# Altium project Power_board_teensy V2.0.PrjPcb
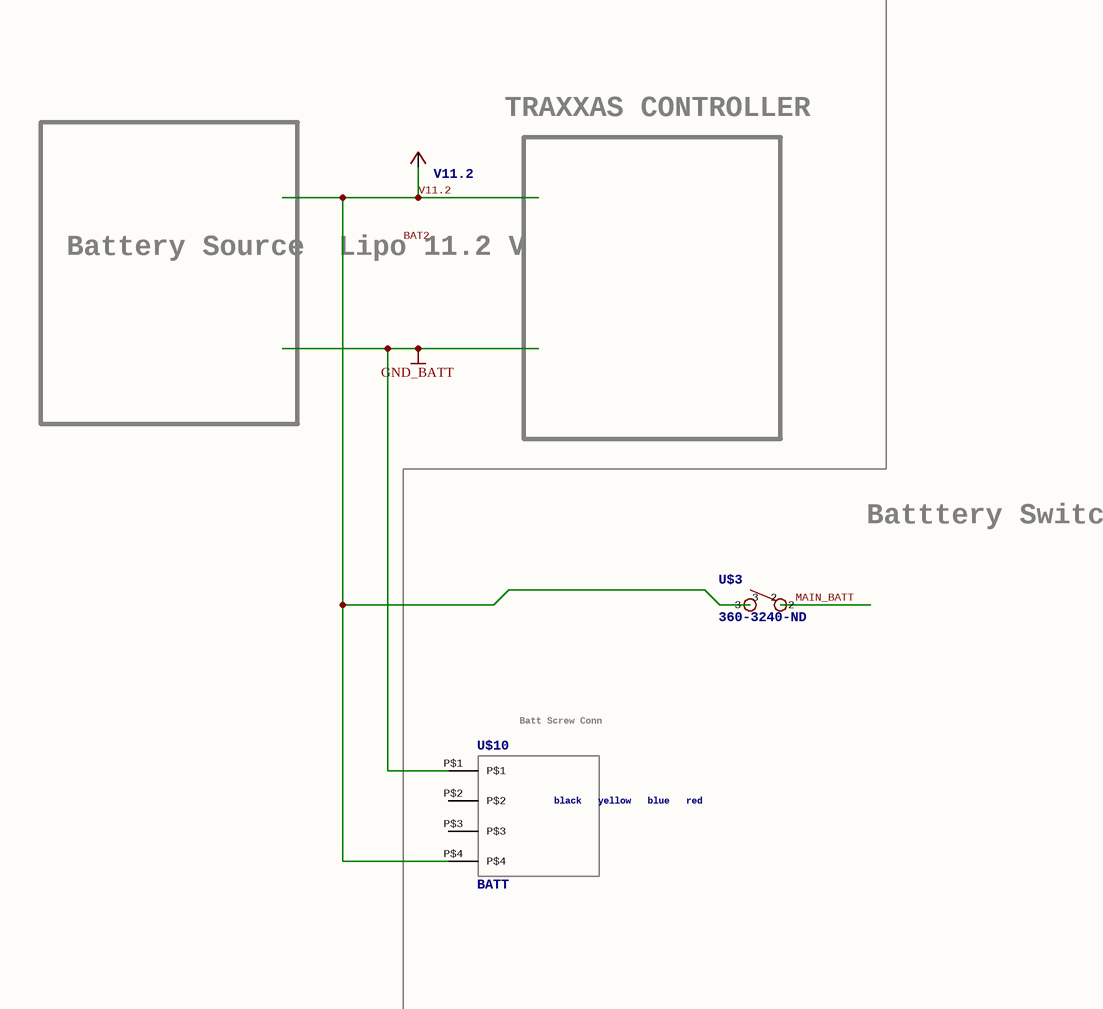
[diagram p0: Power_board_teensy V2.0.SchDoc, left]
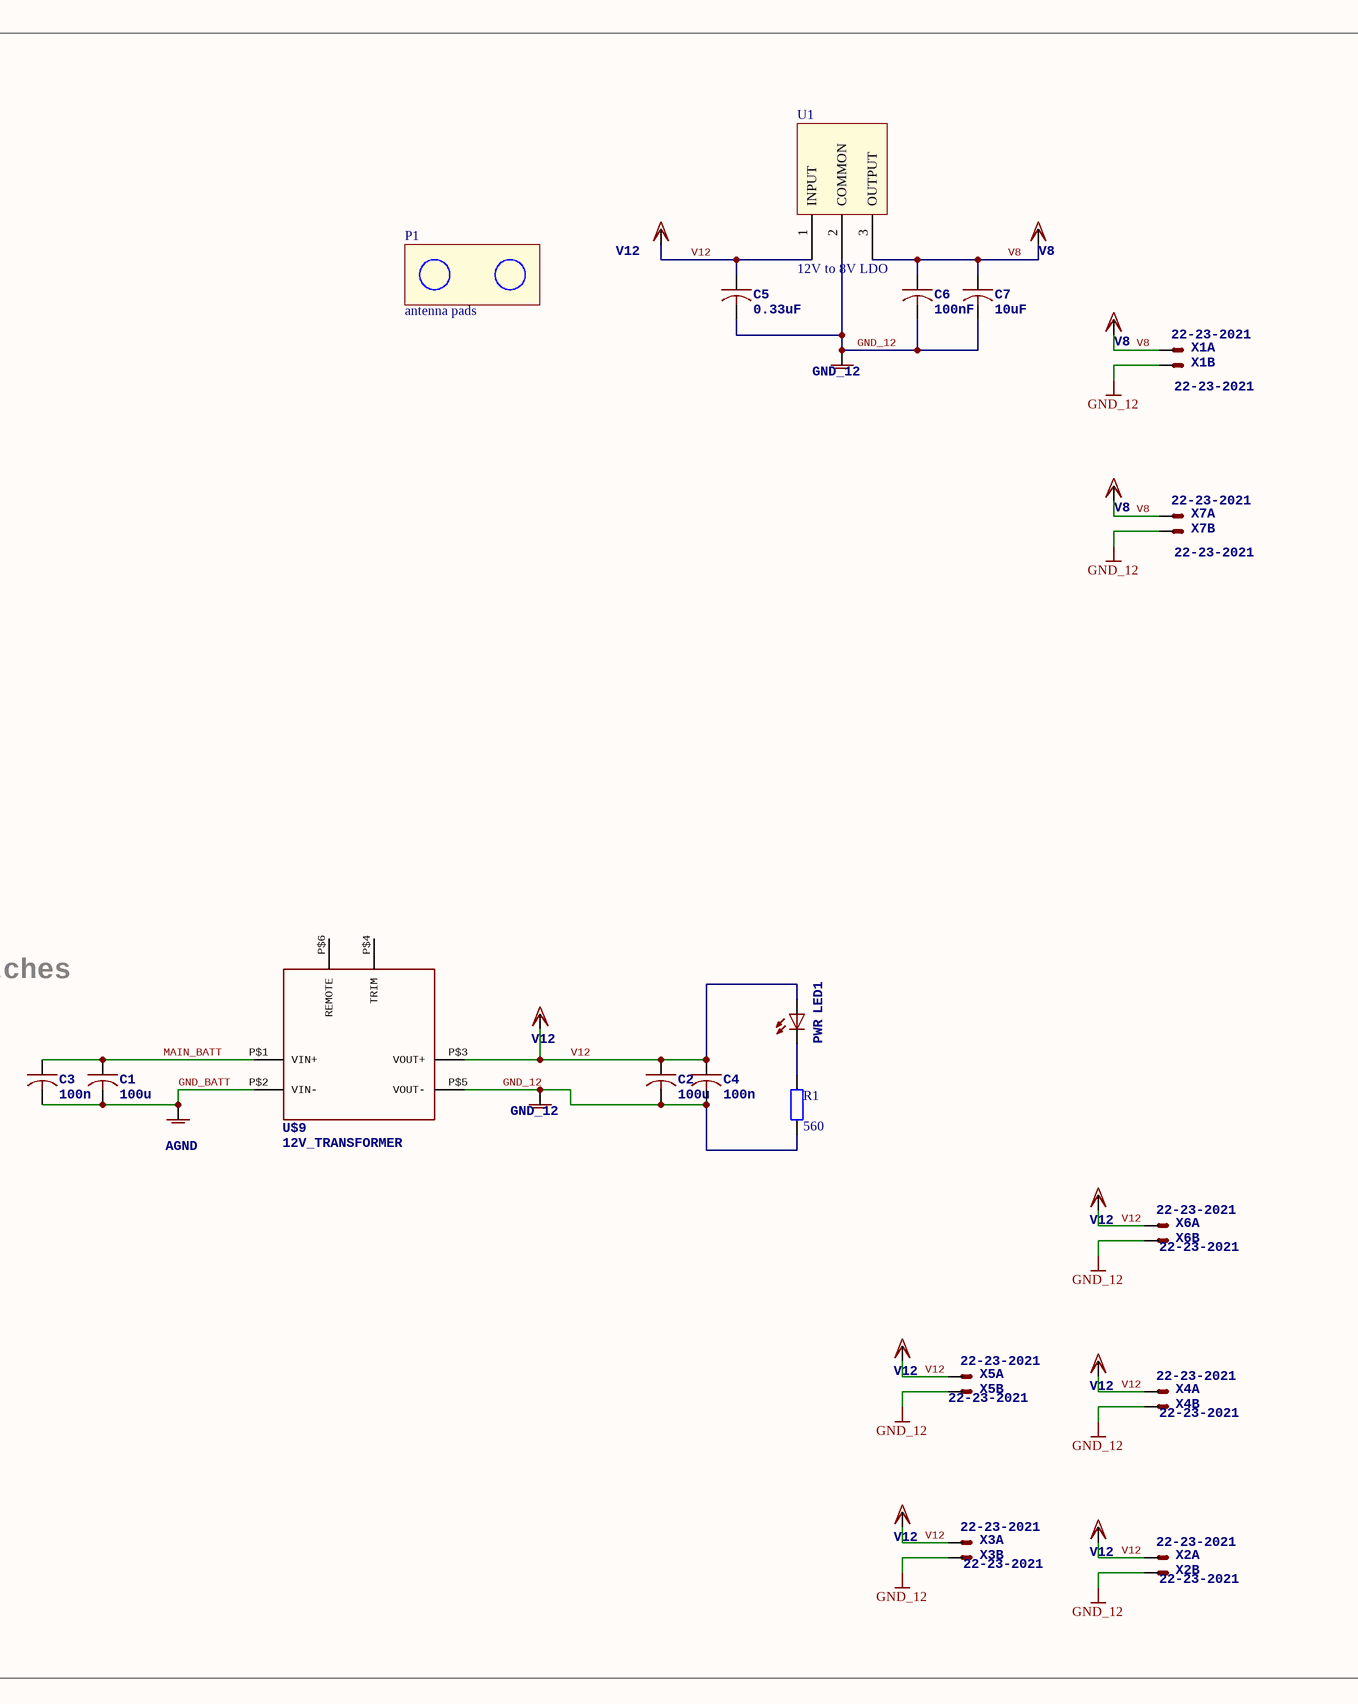
[diagram p1: Power_board_teensy V2.0.SchDoc, right]
1 sheet, 35 parts. Net scope: global (net labels, ports and power ports of the same name join across sheets).
Board file: Power_board_teensy V2.0.PcbDoc

## Sheet Power_board_teensy V2.0.SchDoc
size 436 x 302 mm

### Parts
AGND1  GND_12
AGND2  AGND
AGND3  GND_12
C1  100u  [C050-035X075]
C2  100u  [C050-035X075]
C3  100n  [C050-035X075]
C4  100n  [C050-035X075]
C5  0.33uF  [C050-035X075]
C6  100nF  [C050-035X075]
C7  10uF  [C050-035X075]
LED1  PWR  [LED5MM]
P1  antenna pads  [Antenna pads]
R1  value 560  [AXIAL-0.4]
U1  12V to 8V LDO  [BA7808CP-E2]
U$3  360-3240-ND  [360-3240-ND]
U$9  12V_TRANSFORMER  [12V_TRANSFORMER]
U$10  BATT  black

yellow

blue

red: black / yellow / blue / red  [BATTERY_CONNECTOR]
V1  V11.2
VDD1  V12
VDD2  V8
VDD3  V8
VDD4  V8
VDD5  V12
VDD6  V12
VDD7  V12
VDD8  V12
VDD9  V12
VDD10  V12
X1  22-23-2021  [22-23-2021]  (parts A,B of 2)
X2  22-23-2021  [22-23-2021]  (parts A,B of 2)
X3  22-23-2021  [22-23-2021]  (parts A,B of 2)
X4  22-23-2021  [22-23-2021]  (parts A,B of 2)
X5  22-23-2021  [22-23-2021]  (parts A,B of 2)
X6  22-23-2021  [22-23-2021]  (parts A,B of 2)
X7  22-23-2021  [22-23-2021]  (parts A,B of 2)

### Blocks framed on the sheet
Batttery Switches: AGND1-AGND3 C1-C7 LED1 P1 R1 U1 U$3 U$9 U$10 VDD1-VDD10 X1-X7

### Nets
GND_12: AGND1.?1(AGND) AGND3.?1(AGND) C2.2 C4.2 C5.2 C6.2 C7.2 R1.1 U1.2(COMMON) U$9.P$5(VOUT-) X1.2(S) X2.2(S) X3.2(S) X4.2(S) X5.2(S) X6.2(S) X7.2(S)
GND_BATT: AGND2.?1(AGND) C1.2 C3.2 U$9.P$2(VIN-) U$10.P$1
MAIN_BATT: C1.1 C3.1 U$3.2 U$9.P$1(VIN+)
V8: C6.1 C7.1 U1.3(OUTPUT) VDD2.?1(VDD) VDD3.?1(VDD) VDD4.?1(VDD) X1.1(S) X7.1(S)
V11.2: U$3.3 U$10.P$4 V1.?1(VCC)
V12: C2.1 C4.1 C5.1 LED1.A U1.1(INPUT) U$9.P$3(VOUT+) VDD1.?1(VDD) VDD5.?1(VDD) VDD6.?1(VDD) VDD7.?1(VDD) VDD8.?1(VDD) VDD9.?1(VDD) VDD10.?1(VDD) X2.1(S) X3.1(S) X4.1(S) X5.1(S) X6.1(S)
NetLED1_K: LED1.K(C) R1.2

Not connected (* = marked no-connect by the designer): U$9 P$4(TRIM) P$6(REMOTE); U$10 P$2 P$3

### Notes on the sheet
- TRAXXAS CONTROLLER
- Battery Source
  Lipo 11.2 V
- (near U$10) Batt Screw Conn
- Labels drawn without touching a wire or pin: BAT2

### Library data of the parts
AGND1-AGND3 = AGND: SUPPLY SYMBOL
C1-C7 = C-US050-035X075: CAPACITOR, American symbol
LED1 = LED5MM
R1 = Res2: Resistor; Published: 8-Jun-2000; LatestRevisionDate: 17-Jul-2002; LatestRevisionNote: Re-released for DXP Platform.; PackageReference: AXIAL-0.4; Publisher: Altium Limited; PackageDescription: Axial Device, Thru-Hole; 2 Leads; 0.4 in Pin Spacing
U1 = BA78M08FP-E2
U$3 = 360-3240-ND: SPST two lead switch Pin 2 is common Swtich Closed on Down Position DigiKey: http://www.digikey.com/product-detail/en/nkk-switches/M2011S2A1W01/360-3240-ND/1049342 Data Sheet: http://2t70un3m1d9z1kztamkdrd38.wpengine.netdna-cdn.com/wp-content/uploads/2016/02/MtogglesBushing.pdf
U$9 = 12V_TRANSFORMER: CUI Inc │ SERIES: PDQ30-D │ DESCRIPTION: DC-DC CONVERTER http://www.mouser.com/pdfdocs/pdq30-d.pdf
U$10 = BATTERY_CONNECTOR
V1 = VCC: SUPPLY SYMBOL
VDD1-VDD10 = VDD: SUPPLY SYMBOL
X1-X7 = 22-23-2021: .100" (2.54mm) Center Header - 2 Pin; MF: MOLEX; MPN: 22-23-2021; OC_FARNELL: 1462926; OC_NEWARK: 25C3832